# Altium schematic sheet CAN.SchDoc
size A; SheetNumber: 8; SheetTotal: 8
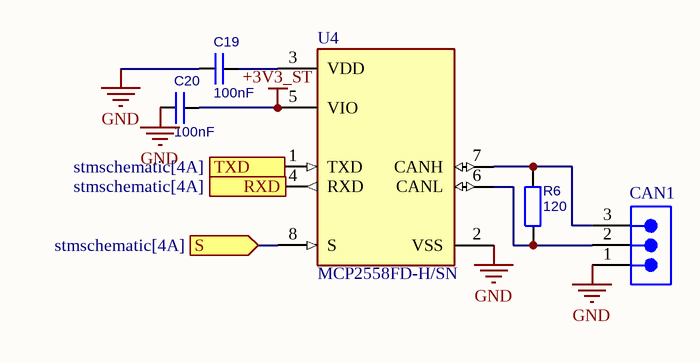
[diagram p0: CAN.SchDoc]

## Parts
C19  100nF  [C0603]
C20  100nF  [C0603]
CAN1  (no value)  [691321100003]
R6  120  [R0603]
U4  MCP2558FD-H/SN  [FP-C04-057-SN-MFG]

## Ports
RXD (in, see stmschematic[4A]), S (in, see stmschematic[4A]), TXD (out, see stmschematic[4A])

## Nets
+3V3_ST: C20.1 U4.5(VIO)
GND: C19.2 C20.2 CAN1.1 U4.2(VSS)
S: U4.8(S) ; port S
NetC19_1: C19.1 U4.3(VDD)
NetCAN1_2: CAN1.2 R6.2 U4.6(CANL)
NetCAN1_3: CAN1.3 R6.1 U4.7(CANH)

Not connected (* = marked no-connect by the designer): U4 1(TXD) 4(RXD)

## Library data of the parts
C19 C20 = C: Capacitor; Value: 100nF
CAN1 = CMP-1502-01784-2: NexarPartId: 18818341; Pitch: 3.5052mm; Current Rating: 10.5A; Number of Positions Per Level: 3; Current: 10A; Voltage: 300V; Gender: Male; Number of Levels: 1; REACH SVHC: Unknown; Height: 12.7mm; Mount: Through Hole; RoHS: Compliant; Contact Gender: Male; Lead Free: Lead Free; Lead Pitch: 3.5mm; Orientation: Vertical; Width: 15.1mm; Color: Green; Number of Contacts: 3; Number of Rows: 1; Length: 7mm; Number of Pins: 3; Termination: Solder; Packaging: Box; Contact Material: Brass
R6 = R: Value: 120
U4 = CMP-06279-000003-1: IC TRANSCEIVER 1/1 8SOIC; Manufacturer: Microchip Technology; Max Supply Voltage: 5.5V; Interface: CAN; Nominal Supply Current: 2.5-95mA; Max Junction Temp: +175°C; Standoff Height: 0.1mm; Min Supply Voltage: 1.7V; Digikey Description: IC TRANSCEIVER 1/1 8SOIC; Device Class L1: Integrated Circuits (ICs); Temperature Range High: +150°C; Temperature: -40°C to +150°C; ComponentLink2URL: http://ww1.microchip.com/downloads/en/DeviceDoc/20005533A.pdf; Device Class L2: Interface ICs; Lead Free: Yes; ComponentLink2Description: Datasheet; Ambient Temperature Range Low: -40°C; Device Class L3: unset; Mouser Description: In a Pack of 10, Microchip Technology MCP2558FD-H/SN, CAN Transceiver 8Mbit/s 1-Channel CAN, 8-Pin SOIC; Manufacturer Part Number: MCP2558FD-H/SN; Category: IC; Octopart: https://octopart.com/mcp2558fd-h%2Fsn-microchip-71590966; Ambient Temperature Range High: +150°C; Automotive: No; RoHS: TRUE; Height: 1.75mm; Package: C04-057-SN; Footprint Url: http://ww1.microchip.com/downloads/en/DeviceDoc/08L_SOIC_150_3dot9mm_SN_C04-00057e.pdf; Temperature Range Low: -40°C